# EAGLE design lasertag (EAGLE 9.3.0)
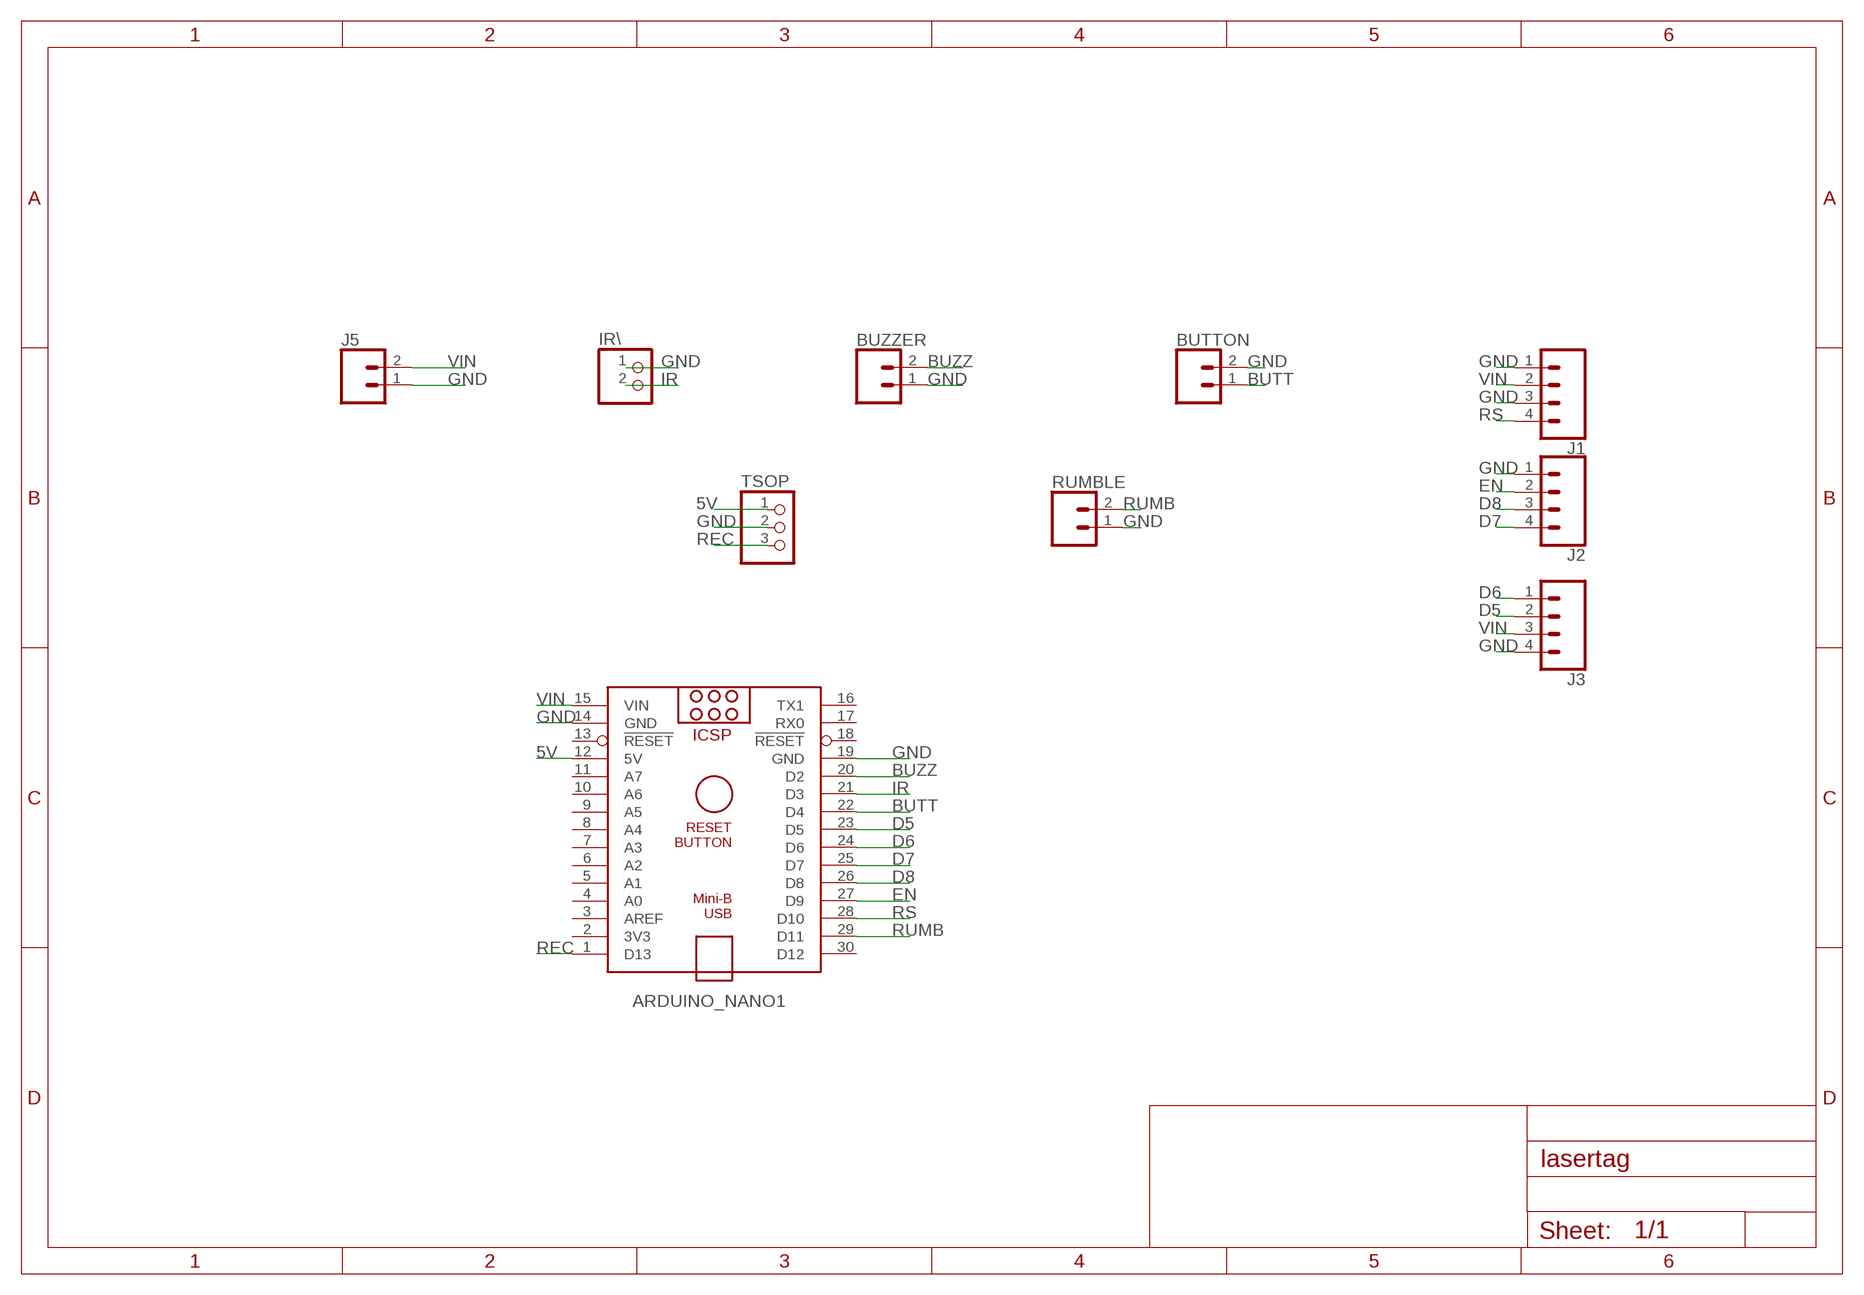
[diagram p0: schematic, sheet 1]

## Parts
ARDUINO_NANO1  ARDUINO_NANO  [ARDUINO_NANO]
BUTTON  CONN_02  [1X02]
BUZZER  CONN_02  [1X02]
IR\  PINHD-1X2  [1X02]
J1  CONN_04JST-PTH-VERT  [JST-4-PTH-VERT]
J2  CONN_04JST-PTH-VERT  [JST-4-PTH-VERT]
J3  CONN_04JST-PTH-VERT  [JST-4-PTH-VERT]
J5  CONN_02JST-PTH-VERT  [JST-2-PTH-VERT]
RUMBLE  CONN_02  [1X02]
TSOP  PINHD-1X3  [1X03]

## Nets
5V: ARDUINO_NANO1.12(5V) TSOP.1
BUTT: ARDUINO_NANO1.22(D4) BUTTON.1
BUZZ: ARDUINO_NANO1.20(D2) BUZZER.2
D5: ARDUINO_NANO1.23(D5) J3.2
D6: ARDUINO_NANO1.24(D6) J3.1
D7: ARDUINO_NANO1.25(D7) J2.4
D8: ARDUINO_NANO1.26(D8) J2.3
EN: ARDUINO_NANO1.27(D9) J2.2
GND: ARDUINO_NANO1.14(GND) ARDUINO_NANO1.19(GND) BUTTON.2 BUZZER.1 IR\.1 J1.1 J1.3 J2.1 J3.4 J5.1 RUMBLE.1 TSOP.2
IR: ARDUINO_NANO1.21(D3) IR\.2
REC: ARDUINO_NANO1.1(D13) TSOP.3
RS: ARDUINO_NANO1.28(D10) J1.4
RUMB: ARDUINO_NANO1.29(D11) RUMBLE.2
VIN: ARDUINO_NANO1.15(VIN) J1.2 J3.3 J5.2
Unconnected: ARDUINO_NANO1.2(3V3) ARDUINO_NANO1.3(AREF) ARDUINO_NANO1.4(A0) ARDUINO_NANO1.5(A1) ARDUINO_NANO1.6(A2) ARDUINO_NANO1.7(A3) ARDUINO_NANO1.8(A4) ARDUINO_NANO1.9(A5) ARDUINO_NANO1.10(A6) ARDUINO_NANO1.11(A7) ARDUINO_NANO1.13(!RESET) ARDUINO_NANO1.16(TX1) ARDUINO_NANO1.17(RX0) ARDUINO_NANO1.18(!RESET) ARDUINO_NANO1.30(D12)

## Library data of the parts
ARDUINO_NANO1 = ArduinoNanoV30:ARDUINO_NANO: Arduino Nano V3.0 Overview: The Arduino Nano is a small, complete, and breadboard-friendly board based on the ATmega328 (Arduino Nano 3.x) or ATmega168 (Arduino Nano 2.x). It has more or less the same functionality of the Arduino Duemilanove, but in a different package. It lacks only a DC power jack, and works with a Mini-B USB cable instead of a standard one. The Nano was designed and is being produced by Gravitech. Specifications: Microcontroller Atmel ATmega168 or ATmega328 Operating Voltage (logic level) 5 V Input Voltage (recommended) 7-12 V Input Voltage (limits) 6-20 V Digital I/O Pins 14 (of which 6 provide PWM output) Analog Input Pins 8 DC Current per I/O Pin 40 mA Flash Memory 16 KB (ATmega168) or 32 KB (ATmega328) of which 2 KB used by bootloader SRAM 1 KB (ATmega168) or 2 KB (ATmega328) EEPROM 512 bytes (ATmega168) or 1 KB (ATmega328) Clock Speed 16 MHz Dimensions 0.73" x 1.70" Length 45 mm Width 18 mm Weigth 5 g Power: The Arduino Nano can be powered via the Mini-B USB connection, 6-20V unregulated external power supply (pin 30), or 5V regulated external power supply (pin 27). The power source is automatically selected to the highest voltage source. Memory: The ATmega168 has 16 KB of flash memory for storing code (of which 2 KB is used for the bootloader); the ATmega328 has 32 KB, (also with 2 KB used for the bootloader). The ATmega168 has 1 KB of SRAM and 512 bytes of EEPROM (which can be read and written with the EEPROM library); the ATmega328 has 2 KB of SRAM and 1 KB of EEPROM. Input and Output: Each of the 14 digital pins on the Nano can be used as an input or output, using pinMode(), digitalWrite(), and digitalRead() functions. They operate at 5 volts. Each pin can provide or receive a maximum of 40 mA and has an internal pull-up resistor (disconnected by default) of 20-50 kOhms. In addition, some pins have specialized functions. Visit Arduino - ArduinoBoardNano <https://www.arduino.cc/en/Main/ArduinoBoardNano>
BUTTON BUZZER RUMBLE = SparkFun-Connectors:CONN_02: Multi connection point. Often used as Generic Header-pin footprint for 0.1 inch spaced/style header connections On any of the 0.1 inch spaced packages, you can populate with these: Break Away Headers - Straight <https://www.sparkfun.com/products/116> (PRT-00116) Break Away Male Headers - Right Angle <https://www.sparkfun.com/products/553> (PRT-00553) Female Headers <https://www.sparkfun.com/products/115> (PRT-00115) Break Away Headers - Machine Pin <https://www.sparkfun.com/products/117> (PRT-00117) Break Away Female Headers - Swiss Machine Pin <https://www.sparkfun.com/products/743> (PRT-00743) For SCREWTERMINALS and SPRING TERMINALS visit here: Screw Terimnals on SparkFun.com <https://www.sparkfun.com/search/results?term=Screw+Terminals> (5mm/3.5mm/2.54mm spacing) This device is also useful as a general connection point to wire up your design to another part of your project. Our various solder wires solder well into these plated through hole pads. Hook-Up Wire - Assortment (Stranded, 22 AWG) <https://www.sparkfun.com/products/11375> (PRT-11375) Hook-Up Wire - Assortment (Solid Core, 22 AWG) <https://www.sparkfun.com/products/11367> (PRT-11367) View the entire wire category on our website here <https://www.sparkfun.com/categories/141> Special notes: Molex polarized connector foot print use with: PRT-08233 with associated crimp pins and housings. 2.54_SCREWTERM for use with PRT-10571. 3.5mm Screw Terminal footprints for PRT-08084 5mm Screw Terminal footprints for use with PRT-08432
IR\ = pinhead:PINHD-1X2: PIN HEADER
J1-J3 = SparkFun-Connectors:CONN_04: Multi connection point. Often used as Generic Header-pin footprint for 0.1 inch spaced/style header connections On any of the 0.1 inch spaced packages, you can populate with these: Break Away Headers - Straight <https://www.sparkfun.com/products/116> (PRT-00116) Break Away Male Headers - Right Angle <https://www.sparkfun.com/products/553> (PRT-00553) Female Headers <https://www.sparkfun.com/products/115> (PRT-00115) Break Away Headers - Machine Pin <https://www.sparkfun.com/products/117> (PRT-00117) Break Away Female Headers - Swiss Machine Pin <https://www.sparkfun.com/products/743> (PRT-00743) For SCREWTERMINALS and SPRING TERMINALS visit here: Screw Terimnals on SparkFun.com <https://www.sparkfun.com/search/results?term=Screw+Terminals> (5mm/3.5mm/2.54mm spacing) This device is also useful as a general connection point to wire up your design to another part of your project. Our various solder wires solder well into these plated through hole pads. Hook-Up Wire - Assortment (Stranded, 22 AWG) <https://www.sparkfun.com/products/11375> (PRT-11375) Hook-Up Wire - Assortment (Solid Core, 22 AWG) <https://www.sparkfun.com/products/11367> (PRT-11367) View the entire wire category on our website here <https://www.sparkfun.com/categories/141> Special notes: Molex polarized connector foot print use with SKU : PRT-08231 with associated crimp pins and housings. 1MM SMD Version SKU: PRT-10208; PROD_ID: CONN-13251
J5 = SparkFun-Retired:CONN_02: Multi connection point. Often used as Generic Header-pin footprint for 0.1 inch spaced/style header connections On any of the 0.1 inch spaced packages, you can populate with these: Break Away Headers - Straight <https://www.sparkfun.com/products/116> (PRT-00116) Break Away Male Headers - Right Angle <https://www.sparkfun.com/products/553> (PRT-00553) Female Headers <https://www.sparkfun.com/products/115> (PRT-00115) Break Away Headers - Machine Pin <https://www.sparkfun.com/products/117> (PRT-00117) Break Away Female Headers - Swiss Machine Pin <https://www.sparkfun.com/products/743> (PRT-00743) For SCREWTERMINALS and SPRING TERMINALS visit here: Screw Terimnals on SparkFun.com <https://www.sparkfun.com/search/results?term=Screw+Terminals> (5mm/3.5mm/2.54mm spacing) This device is also useful as a general connection point to wire up your design to another part of your project. Our various solder wires solder well into these plated through hole pads. Hook-Up Wire - Assortment (Stranded, 22 AWG) <https://www.sparkfun.com/products/11375> (PRT-11375) Hook-Up Wire - Assortment (Solid Core, 22 AWG) <https://www.sparkfun.com/products/11367> (PRT-11367) View the entire wire category on our website here <https://www.sparkfun.com/categories/141> Special notes: Molex polarized connector foot print use with: PRT-08233 with associated crimp pins and housings. 2.54_SCREWTERM for use with PRT-10571. 3.5mm Screw Terminal footprints for PRT-08084 5mm Screw Terminal footprints for use with PRT-08432; PROD_ID: CONN-12097
TSOP = pinhead:PINHD-1X3: PIN HEADER

## Board
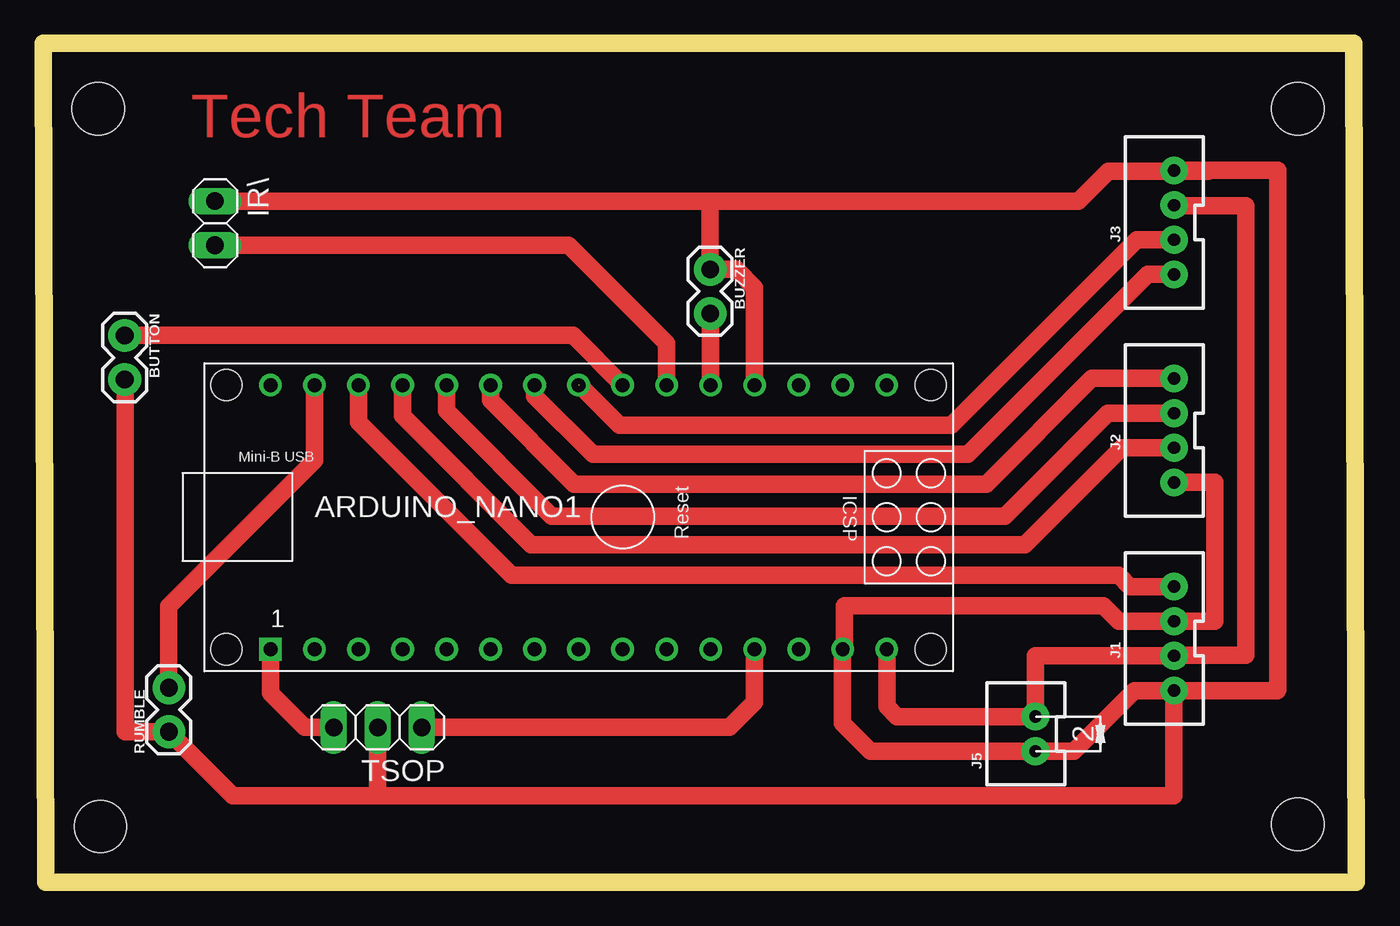
[diagram p1: board, top side]

Size 75.76 x 48.4 mm. Coordinates in mm from the lower left corner, seen from the top.
Outline: 0,48.4 75.63,48.4 75.76,0 0.13,0 0,48.4
Copper layers (1*16): Top 0.035mm / dielectric 1.5mm / Bottom 0.035mm
Design rules "default": minimum track width 6mil, minimum drill 0.35mm, track to track 6mil, track to pad 6mil, pad to pad 6mil, via to via 6mil, smd to smd 6mil, copper to edge 40mil, drill to drill 6mil, minimum pad ring 10mil, minimum via ring 8mil, stop-mask expansion 4mil, vias tented up to drill 0mil, thermal gap 10mil
Holes 3 mm at 3.17,44.62 72.39,44.62 72.39,3.35 3.3,3.22

### Footprints (pad centres in the part's own frame; a part is rotated, then mirrored left to right if it is on the bottom)
ARDUINO_NANO = drill 0.8 square: 1 -20.32,-7.62 | drill 0.8: 2 -17.78,-7.62; 3 -15.24,-7.62; 4 -12.7,-7.62; 5 -10.16,-7.62; 6 -7.62,-7.62; 7 -5.08,-7.62; 8 -2.54,-7.62; 9 0,-7.62; 10 2.54,-7.62; 11 5.08,-7.62; 12 7.62,-7.62; 13 10.16,-7.62; 14 12.7,-7.62; 15 15.24,-7.62; 16 15.24,7.62; 17 12.7,7.62; 18 10.16,7.62; 19 7.62,7.62; 20 5.08,7.62; 21 2.54,7.62; 22 0,7.62; 23 -2.54,7.62; 24 -5.08,7.62; 25 -7.62,7.62; 26 -10.16,7.62; 27 -12.7,7.62; 28 -15.24,7.62; 29 -17.78,7.62; 30 -20.32,7.62 | hole 1.778: -22.86,-7.62; -22.86,7.62; 17.78,7.62; 17.78,-7.62
1X02 = drill 1.016 pad 1.88: 1 0,0; 2 2.54,0
1X02' = drill 1.016 long: 1 -1.27,0; 2 1.27,0
JST-4-PTH-VERT = drill 0.7 pad 1.6: 1 -3,-0.55; 2 -1,-0.55; 3 1,-0.55; 4 3,-0.55
JST-2-PTH-VERT = drill 0.7 pad 1.6: 1 -1,-0.55; 2 1,-0.55
1X03 = drill 1.016 long: 1 -2.54,0; 2 0,0; 3 2.54,0

### Placement (x,y rotation side)
ARDUINO_NANO1  33.43,21.06 0 top
BUTTON  4.7,31.54 270 top
BUZZER  38.48,35.35 270 top
IR\  [1X02']  9.91,38.02 270 top
J1  64.7,14.06 90 top
J2  64.7,26.06 90 top
J3  64.7,38.06 90 top
J5  56.7,8.56 90 top
RUMBLE  7.24,8.68 90 top
TSOP  19.3,8.94 180 top

### Tracks (layer width: path | path; a pad name or v marks a point on that pad's centre or on a via)
5V
  Top 1.016: ARDUINO_NANO1.12 41.05,10.4 39.59,8.94 TSOP.1
BUTT
  Top 1.016: ARDUINO_NANO1.22 30.57,31.54 BUTTON.1
BUZZ
  Top 0.813: BUZZER.2 38.51,32.79
  Top 1.016: 38.51,32.79 ARDUINO_NANO1.20
D5  (1 unrouted)
  Top 1.016: 30.95,28.68 33.26,26.37 52.41,26.37 63.1,37.06 J3.2
D6
  Top 1.016: ARDUINO_NANO1.24 28.35,28.05 31.71,24.68 53.36,24.68 63.74,35.06 J3.1
D7
  Top 1.016: J2.4 60.52,29.06 54.42,22.97 30.63,22.97 25.81,27.79 ARDUINO_NANO1.25
D8
  Top 1.016: ARDUINO_NANO1.26 23.27,27.2 29.34,21.13 55.5,21.13 61.43,27.06 J2.3
EN
  Top 1.016: J2.2 62.23,25.06 56.64,19.48 28.16,19.48 20.73,26.9 ARDUINO_NANO1.27
GND
  Top 1.016: J2.1 67.59,23.06 67.59,15.06 J1.3 62.07,15.06 61.18,15.95 46.23,15.95 46.23,13.54 ARDUINO_NANO1.14 46.13,9.16 47.73,7.56 J5.1 | J1.1 65.25,5 19.3,5 | 19.3,5 TSOP.2 | 19.3,5 10.92,5 RUMBLE.1 4.72,8.68 4.72,28.98 BUTTON.2 | 38.48,39.29 IR\.1 | 38.48,39.29 BUZZER.1 40,35.35 41.05,34.31 ARDUINO_NANO1.19 | 38.48,39.29 59.73,39.29 61.47,41.03 67.22,41.03 J3.4 71.25,41.06 71.25,11.1 71.21,11.06 J1.1 | J5.1 57.28,7.59 | J5.1 59.46,7.56 62.96,11.06 J1.1
IR
  Top 1.016: IR\.2 30.31,36.75 35.97,31.1 ARDUINO_NANO1.21
REC
  Top 1.016: ARDUINO_NANO1.1 13.11,10.9 15.07,8.94 TSOP.3
RS
  Top 1.016: ARDUINO_NANO1.28 18.19,26.52 27.01,17.7 62.07,17.7 62.71,17.06 J1.4
RUMB
  Top 1.016: RUMBLE.2 7.24,15.92 15.65,24.33 ARDUINO_NANO1.29
VIN
  Top 1.016: ARDUINO_NANO1.15 48.67,10.16 49.26,9.56 J5.2 57.25,13.06 J1.2 65.28,13.1 69.39,13.1 69.39,39.03 65.28,39.03 J3.3

### Text on the board
Top: Tech Team